# Altium schematic sheet HBridge.SchDoc
size A3; SheetNumber: 2; SheetTotal: 5
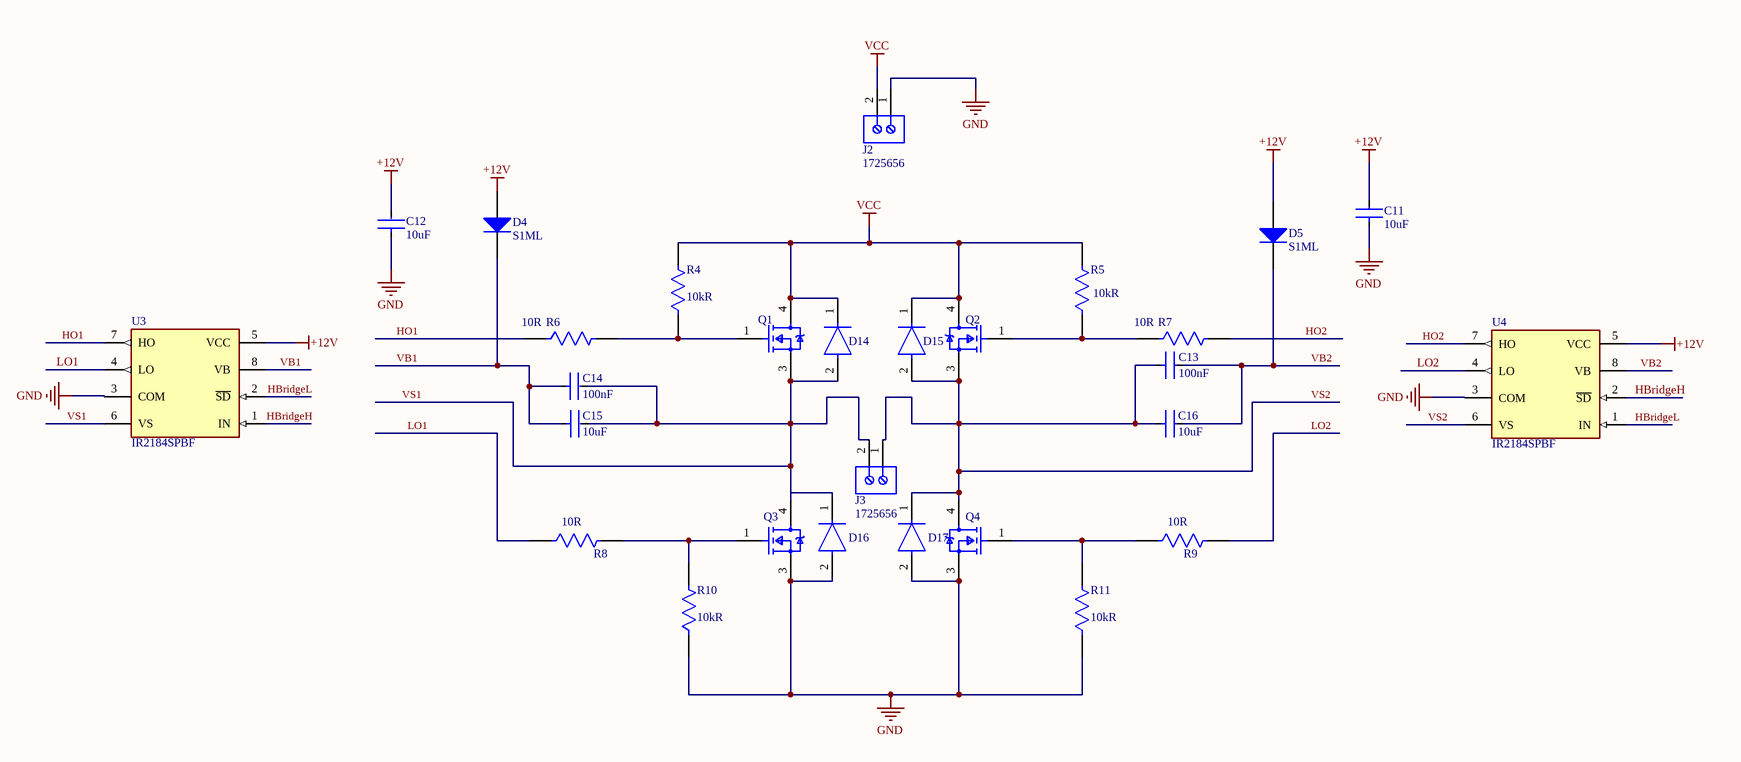
[diagram p0: HBridge.SchDoc]

## Parts
C11  Capacitance: 10uF  [FP-CL21-IPC_B]  (hidden comment: CL21A106KOQNNNE)
C12  Capacitance: 10uF  [FP-CL21-IPC_B]  (hidden comment: CL21A106KOQNNNE)
C13  Capacitance: 100nF  [FP-CL21-IPC_C]  (hidden comment: CL21B104KBCNNNC)
C14  Capacitance: 100nF  [FP-CL21-IPC_C]  (hidden comment: CL21B104KBCNNNC)
C15  Capacitance: 10uF  [FP-CL21-IPC_B]  (hidden comment: CL21A106KOQNNNE)
C16  Capacitance: 10uF  [FP-CL21-IPC_B]  (hidden comment: CL21A106KOQNNNE)
D4  S1ML  [TWS-S1ML_V]
D5  S1ML  [TWS-S1ML_V]
D14  1N4148WQ-7-F  [FP-SOD123-MFG]  (value not drawn)
D15  1N4148WQ-7-F  [FP-SOD123-MFG]  (value not drawn)
D16  1N4148WQ-7-F  [FP-SOD123-MFG]  (value not drawn)
D17  1N4148WQ-7-F  [FP-SOD123-MFG]  (value not drawn)
J2  1725656  [PHOE-1725656-2]
J3  1725656  [PHOE-1725656-2]
Q1  IRLZ44NSTRLPBF  [FP-PG-TO263-3-MFG]  (value not drawn)
Q2  IRLZ44NSTRLPBF  [FP-PG-TO263-3-MFG]  (value not drawn)
Q3  IRLZ44NSTRLPBF  [FP-PG-TO263-3-MFG]  (value not drawn)
Q4  IRLZ44NSTRLPBF  [FP-PG-TO263-3-MFG]  (value not drawn)
R4  Resistance: 10kR  [FP-MCA1206-IPC_B]  (hidden comment: MCA1206MD1002DP500)
R5  Resistance: 10kR  [FP-MCA1206-IPC_B]  (hidden comment: MCA1206MD1002DP500)
R6  Resistance: 10R  [FP-RMCF0805-IPC_B]  (hidden comment: RMCF0805FG10R0)
R7  Resistance: 10R  [FP-RMCF0805-IPC_B]  (hidden comment: RMCF0805FG10R0)
R8  Resistance: 10R  [FP-RMCF0805-IPC_B]  (hidden comment: RMCF0805FG10R0)
R9  Resistance: 10R  [FP-RMCF0805-IPC_B]  (hidden comment: RMCF0805FG10R0)
R10  Resistance: 10kR  [FP-MCA1206-IPC_B]  (hidden comment: MCA1206MD1002DP500)
R11  Resistance: 10kR  [FP-MCA1206-IPC_B]  (hidden comment: MCA1206MD1002DP500)
U3  IR2184SPBF  [FP-PG-DSO-8-MFG]
U4  IR2184SPBF  [FP-PG-DSO-8-MFG]

## Nets
+12V: C11.2 C12.2 D4.1(A) D5.1(A) U3.5(VCC) U4.5(VCC)
GND: C11.1 C12.1 D16.2(A) D17.2(A) J2.1 Q3.3(S) Q4.3(S) R10.1 R11.1 U3.3(COM) U4.3(COM)
VCC: D14.1(C) D15.1(C) J2.2 Q1.4(D) Q2.4(D) R4.2 R5.2
HBridgeH: U3.1(IN) U4.2(~{SD})
HBridgeL: U3.2(~{SD}) U4.1(IN)
HO1: R6.1 U3.7(HO)
HO2: R7.2 U4.7(HO)
LO1: R8.1 U3.4(LO)
LO2: R9.2 U4.4(LO)
VB1: C14.1 C15.1 D4.2(K) U3.8(VB)
VB2: C13.2 C16.2 D5.2(K) U4.8(VB)
VS1: C14.2 C15.2 D14.2(A) D16.1(C) J3.2 Q1.3(S) Q3.4(D) U3.6(VS)
VS2: C13.1 C16.1 D15.2(A) D17.1(C) J3.1 Q2.3(S) Q4.4(D) U4.6(VS)
NetQ1_1: Q1.1(G) R4.1 R6.2
NetQ2_1: Q2.1(G) R5.1 R7.1
NetQ3_1: Q3.1(G) R8.2 R10.2
NetQ4_1: Q4.1(G) R9.1 R11.2

## Library data of the parts
C11 C12 C15 C16 = CMP-2000-06102-2: CL21 Series 0805 10uF 16V ±10% Tolerance X5R Multilayer Ceramic Chip Capacitor; Dielectric: X7R; Length: 2mm; Depth: 1.25mm; Voltage: 16V; Width: 0.049inch; Lead Free: Lead Free; Max Operating Temperature: 85°C; Mount: Surface Mount; Voltage Rating: 16V; Height: 1.25mm; Radiation Hardening: No; Packaging: Tape and Reel; Voltage Rating (DC): 16V; Thickness: 0.055inch; Case/Package: 0805; Case Code (Imperial): 0805; Min Operating Temperature: -55°C; Case Code (Metric): 2012; Package Quantity: 1; Tolerance: 10%
C13 C14 = CMP-2000-05017-2: CL21 Series 0805 100nF 50V ±10% Tolerance X7R Multilayer Ceramic Chip Capacitor; Depth: 1.25mm; Height: 0.85mm; Width: 0.049inch; Tolerance: 10%; Case Code (Metric): 2012; Case Code (Imperial): 0805; Material: Ceramic; Thickness: 0.037inch; Min Operating Temperature: -55°C; Contact Plating: Tin; Length: 2mm; Mount: Surface Mount; Voltage Rating (DC): 50V; Lead Free: Lead Free; Dielectric: X7R; Radiation Hardening: No; Voltage Rating: 50V; Case/Package: 0805; Packaging: Tape and Reel; Max Operating Temperature: 125°C; Voltage: 50V
D4 D5 = CMP-2000-07014-1: Rectifier, 1 A, 1.1 V, -55 to 175 degC, 2-Pin SMD, RoHS, Tape and Reel; Manufacturer: Taiwan Semiconductor; Forward Current If(AV): 1A; Forward Voltage VF Max: 1.1V; Diode Configuration: Single; Reverse Recovery Time trr Max: 1.8µs; Forward Surge Current Ifsm Max: 30A; SVHC: NoSVHC(15-Jun-2015); Repetitive Reverse Voltage Vrrm Max: 1kV; No. of Pins: 2Pin; Mounting Technology: SurfaceMount; Package Reference: S1ML; Datasheet URL: http://www.taiwansemi.com/products/datasheet/S1AL%20SERIES_O15.pdf; Manufacturer URL: http://www.taiwansemi.com/; Package Description: 2-Pin Surface Mount Device, Body 2.8 x 1.8 mm; Product Range: -; Diode Case Style: SMD; Datasheet Version: Rev. O15, 05/2015; Packaging: CutTape; Operating Temperature Max: 150°C
D14-D17 = CMP-12791-000025-1: DIODE GEN PURP 100V 300MA SOD123; Manufacturer: Diodes Inc.; Value: 2pF; Standoff Height: 0mm; Automotive Grade: Grade 0; Max Junction Temp: +150°C; Max Surge Forward Current: 1A; Peak Reverse Current: 1uA; Forward Current: 300mA; Temperature: -65°C to +150°C; Device Class L3: Rectifier Diodes; Manufacturer Part Number: 1N4148WQ-7-F; Temperature Range Low: -65°C; Device Class L1: Discrete Semiconductors; Reverse Voltage: 100V; Automotive: Yes; Temperature Range High: +150°C; Octopart: https://octopart.com/1n4148wq-7-f-diodes+inc.-34965875; ComponentLink2URL: https://www.diodes.com/assets/Datasheets/ds30086.pdf; Max Repetitive Reverse Voltage: 100V; Mouser Description: Diode Switching 100V 0.15A Automotive 2-Pin SOD-123 T/R; Ipc Land Pattern Name: SOD365155X123-2; RoHS: TRUE; Height: 1.45mm; ComponentLink2Description: Datasheet; Category: Diode; Footprint Url: https://www.diodes.com/assets/Package-Files/SOD123.pdf; Package: SOD123; Device Class L2: Diodes; Lead Free: Yes; Capacitance: 2pF; Digikey Description: DIODE GEN PURP 100V 300MA SOD123
J2 J3 = CMP-2000-05299-1: Male Header, Pitch 2.54 mm, 1 x 2 Position, Height 9 mm, Tail Length 3.5 mm; Manufacturer: Phoenix Contact; Number of contacts: 2; Content: 250pc(s); Pitch: 2.54mm; Industrial packaging: Yes; Colour: Green; Manufacturer part No.: 1725656; Type: MPT0,5/2-2,54; Datasheet URL: http://datasheet.octopart.com/1725656-Phoenix-Contact-datasheet-5302866.pdf; Manufacturer URL: http://www.phoenixcontact.com/; Datasheet Version: Apr-08
Q1-Q4 = CMP-32901-000495-1: MOSFET N-CH 55V 47A D2PAK; Rds On Max: 22mR; Input Capacitance: 1.7nF; Turn-On Delay Time: 11ns; Turn-Off Delay Time: 26ns; Power Dissipation: 110W; Element Configuration: Single; Gate to Source Voltage (Vgs): 16V; Drain to Source Resistance: 35mR; Threshold Voltage: 2V; Max Power Dissipation: 3.8W; Lead Free: Contains Lead; Max Dual Supply Voltage: 55V; Width: 0.38inch; Mount: Surface Mount; Continuous Drain Current (ID): 47A; Min Operating Temperature: -55°C; Number of Pins: 3; REACH SVHC: No SVHC; Height: 0.19inch; Length: 0.42inch; Case/Package: D2PAK; Drain to Source Breakdown Voltage: 55V; Packaging: Tape and Reel; Drain to Source Voltage (Vdss): 55V; Halogen Free: Halogen Free; RoHS Compliant: Yes; Max Operating Temperature: 175°C
R4 R5 R10 R11 = CMP-02407-011266-1: Res MC AT Professional Thin Film 1206 10kΩ 0.5% 0.4W ±25ppm/°C Molded Paper T/R; Voltage Rating: 200V; Max Power Dissipation: 400mW; Weight: 0.000325oz; Height: 0.55mm; Case Code (Imperial): 1206; Packaging: Tape and Reel; Series: MCA AT - Professional; Width: 1.6mm; Resistor Type: Thin Film; Tolerance: 0.5%; Max Operating Temperature: 175°C; Termination: SMD/SMT; Min Operating Temperature: -55°C; Temperature Coefficient: 25ppm/°C; Number of Terminations: 2; Length: 3.2mm; RoHS Compliant: Yes; Case Code (Metric): 3216; Case/Package: 1206; Features: Automotive AEC-Q200; Power Rating: 400mW
R6-R9 = CMP-26527-004108-1: 10Ω ±1% 0.125W 0805 Thick Film Chip Resistor AEC-Q200 compliant; Max Power Dissipation: 125mW; Temperature Coefficient: 100ppm/°C; Series: RMCF; Resistor Type: Thick Film; Width: 0.049inch; Contact Plating: Tin; Number of Terminations: 2; Radiation Hardening: No; Max Operating Temperature: 155°C; Length: 0.079inch; RoHS Compliant: Yes; Mount: Surface Mount; Tolerance: 1%; Case/Package: 0805; Packaging: Tape and Reel; Min Operating Temperature: -55°C; Height: 0.026inch; Features: Automotive AEC-Q200
U3 U4 = CMP-32851-000025-1: IC GATE DRVR HALF-BRIDGE 8SOIC; Manufacturer: Infineon; Min Supply Voltage: 10V; Number Of Outputs: 1; Turn On Delay Time: 680ns; Max Supply Voltage: 20V; Number Of Drivers: 2; Max Junction Temp: +150°C; Nominal Supply Current: 60-1000uA; Turn Off Delay Time: 270ns; Standoff Height: 0.1mm; Max Power Dissipation: 0.625W; Rise Time: 40ns; Fall Time: 20ns; Temperature: to +150°C; Height: 1.75mm; Ambient Temperature Range High: +125°C; Manufacturer Part Number: IR2184SPBF; ComponentLink2URL: https://www.infineon.com/dgdl/ir2184.pdf?fileId=5546d462533600a4015355c955e616d4; ComponentLink2Description: Datasheet; RoHS: TRUE; Octopart: https://octopart.com/ir2184spbf-infineon-65872954; Ipc Land Pattern Name: SOIC127P600X155-8; Package: PG-DSO-8; Footprint Url: https://www.infineon.com/dgdl/Infineon-po-8leadsoic-P-v01_00-EN.pdf?fileId=5546d462580663ef0158068b4ad80177; Category: IC; Digikey Description: IC GATE DRVR HALF-BRIDGE 8SOIC; Automotive: No; Device Class L3: Gate Drivers; Device Class L2: Power Management ICs; Temperature Range High: +150°C; Lead Free: Yes; Ambient Temperature Range Low: -40°C; Device Class L1: Integrated Circuits (ICs)